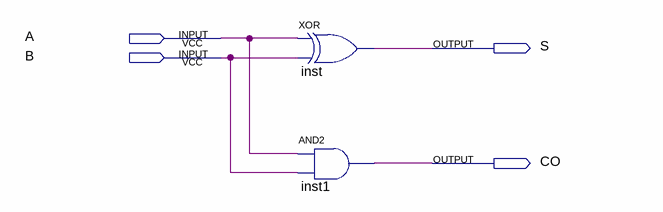
[diagram p0: schematic sheet]
// Quartus schematic half_add.bdf as structural Verilog: 2 symbols, 4 pins
module half_add (
  input  A,
  input  B,
  output S,
  output CO
);

  xor inst (S, A, B);
  and inst1 (CO, A, B);
endmodule
